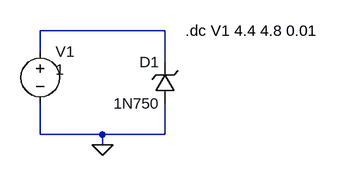
[diagram p0: schematic 4-3.asc]
4-3.asc, the LTspice schematic file:
Version 4
SHEET 1 880 680
WIRE 256 96 64 96
WIRE 64 128 64 96
WIRE 256 144 256 96
WIRE 64 256 64 208
WIRE 160 256 64 256
WIRE 256 256 256 208
WIRE 256 256 160 256
WIRE 160 272 160 256
FLAG 160 272 0
SYMBOL zener 272 208 R180
WINDOW 0 24 64 Left 2
WINDOW 3 24 0 Left 2
SYMATTR InstName D1
SYMATTR Value 1N750
SYMBOL voltage 64 112 R0
WINDOW 3 24 44 Left 2
WINDOW 123 0 0 Left 0
WINDOW 39 0 0 Left 0
SYMATTR InstName V1
SYMATTR Value 1
TEXT 288 96 Left 2 !.dc V1 4.4 4.8 0.01

The netlist it stands for:
* 4-3.asc
D1 0 N001 1N750
V1 N001 0 1
.model D D
.lib standard.dio
.dc V1 4.4 4.8 0.01
.backanno
.end